# Altium schematic sheet DigitalCarrierJack.SchDoc
size A4; CompanyName: Technische Hochschule Nürnberg Georg Simon Ohm; Organization: UltraZohm; Address1: Kesslerplatz 12; Address2: 90489 Nürnberg; Address3: GERMANY; DocumentNumber: 2; SheetNumber: 2; SheetTotal: 3; Website: www.ultrazohm.com
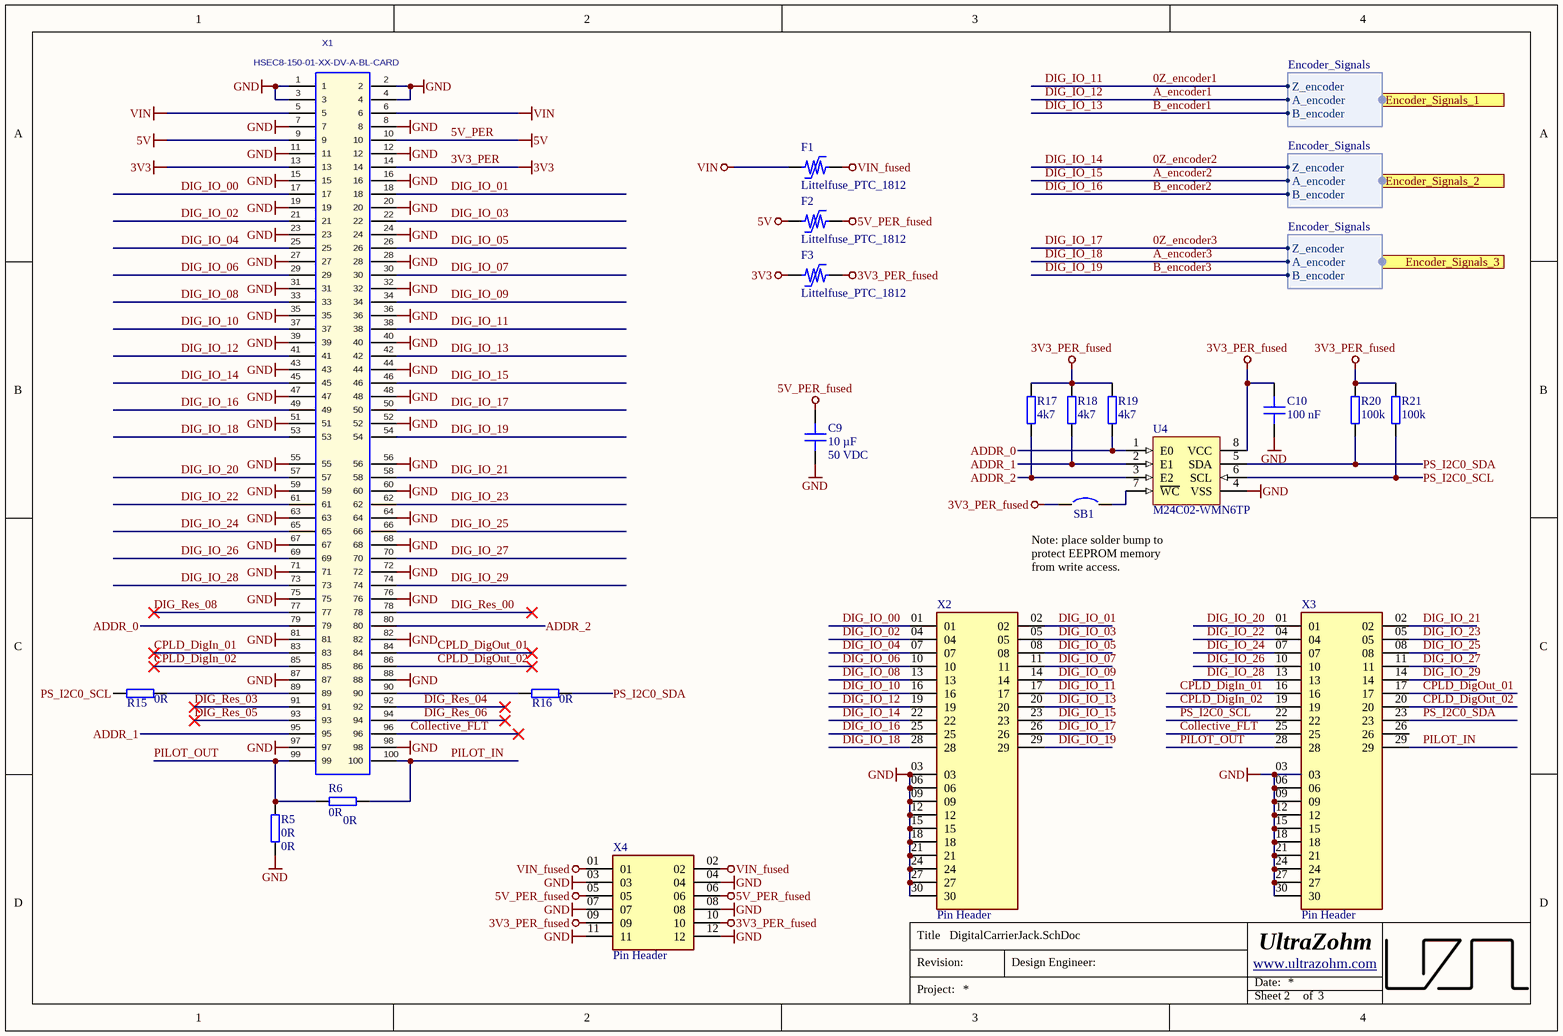
[diagram p0: DigitalCarrierJack.SchDoc]

## Parts
C9  10 µF  Voltage Rating: 50 VDC  [C_1206]
C10  100 nF  [C_0603]
F1  Littelfuse_PTC_1812  [1812_PTC_Polyfuse_Littelfuse]
F2  Littelfuse_PTC_1812  [1812_PTC_Polyfuse_Littelfuse]
F3  Littelfuse_PTC_1812  [1812_PTC_Polyfuse_Littelfuse]
R5  0R  [RES 0603_1608]
R6  0R  [RES 0603_1608]
R15  0R  [RES 0603_1608]
R16  0R  [RES 0603_1608]
R17  4k7  [RES 0603_1608]
R18  4k7  [RES 0603_1608]
R19  4k7  [RES 0603_1608]
R20  100k  [RES 0603_1608]
R21  100k  [RES 0603_1608]
SB1  (no value)  [SB_0603]  (no BOM)
U4  M24C02-WMN6TP  [D0008A_N]
X1  HSEC8-150-01-XX-DV-A-BL-CARD  [HSEC8-150-01-XX-DV-A-BL-CARD]  (no BOM)
X2  Pin Header  [SAMTEC_TSW-110-07-F-T]
X3  Pin Header  [SAMTEC_TSW-110-07-F-T]
X4  Pin Header  [SAMTEC_TSW-106-07-F-D]

## Ports
Encoder_Signals_1 (harness Encoder_Signals), Encoder_Signals_2 (harness Encoder_Signals), Encoder_Signals_3 (harness Encoder_Signals)

## Harnesses
Encoder_Signals: A_encoder, B_encoder, Z_encoder

## Nets
3V3_PER: F3.1 X1.13 X1.14  [also labelled 3V3]
3V3_PER_fused: C10.2 F3.2 R17.2 R18.2 R19.2 R20.2 R21.2 SB1.1 U4.8(VCC) X4.09 X4.10
5V_PER: F2.1 X1.9 X1.10  [also labelled 5V]
5V_PER_fused: C9.2 F2.2 X4.05 X4.06
GND: C9.1 C10.1 R5.1 U4.4(VSS) X1.1 X1.2 X1.3 X1.4 X1.7 X1.8 X1.11 X1.12 X1.15 X1.16 X1.19 X1.20 X1.23 X1.24 X1.27 X1.28 X1.31 X1.32 X1.35 X1.36 X1.39 X1.40 X1.43 X1.44 X1.47 X1.48 X1.51 X1.52 X1.55 X1.56 X1.59 X1.60 X1.63 X1.64 X1.67 X1.68 X1.71 X1.72 X1.75 X1.76 X1.81 X1.82 X1.87 X1.88 X1.97 X1.98 X2.03 X2.06 X2.09 X2.12 X2.15 X2.18 X2.21 X2.24 X2.27 X2.30 X3.03 X3.06 X3.09 X3.12 X3.15 X3.18 X3.21 X3.24 X3.27 X3.30 X4.03 X4.04 X4.07 X4.08 X4.11 X4.12
VIN: F1.1 X1.5 X1.6
VIN_fused: F1.2 X4.01 X4.02
0Z_encoder1: X1.38 X2.17 ; port Encoder_Signals_1.Z_encoder  [also labelled DIG_IO_11]
0Z_encoder2: X1.45 X2.22 ; port Encoder_Signals_2.Z_encoder  [also labelled DIG_IO_14]
0Z_encoder3: X1.50 X2.26 ; port Encoder_Signals_3.Z_encoder  [also labelled DIG_IO_17]
A_encoder1: X1.41 X2.19 ; port Encoder_Signals_1.A_encoder  [also labelled DIG_IO_12]
A_encoder2: X1.46 X2.23 ; port Encoder_Signals_2.A_encoder  [also labelled DIG_IO_15]
A_encoder3: X1.53 X2.28 ; port Encoder_Signals_3.A_encoder  [also labelled DIG_IO_18]
ADDR_0: R19.1 U4.1(E0) X1.79
ADDR_1: R18.1 U4.2(E1) X1.95
ADDR_2: R17.1 U4.3(E2) X1.80
B_encoder1: X1.42 X2.20 ; port Encoder_Signals_1.B_encoder  [also labelled DIG_IO_13]
B_encoder2: X1.49 X2.25 ; port Encoder_Signals_2.B_encoder  [also labelled DIG_IO_16]
B_encoder3: X1.54 X2.29 ; port Encoder_Signals_3.B_encoder  [also labelled DIG_IO_19]
Collective_FLT: X1.96 X3.25
CPLD_DigIn_01: X1.83 X3.16
CPLD_DigIn_02: X1.85 X3.19
CPLD_DigOut_01: X1.84 X3.17
CPLD_DigOut_02: X1.86 X3.20
DIG_IO_00: X1.17 X2.01
DIG_IO_01: X1.18 X2.02
DIG_IO_02: X1.21 X2.04
DIG_IO_03: X1.22 X2.05
DIG_IO_04: X1.25 X2.07
DIG_IO_05: X1.26 X2.08
DIG_IO_06: X1.29 X2.10
DIG_IO_07: X1.30 X2.11
DIG_IO_08: X1.33 X2.13
DIG_IO_09: X1.34 X2.14
DIG_IO_10: X1.37 X2.16
DIG_IO_20: X1.57 X3.01
DIG_IO_21: X1.58 X3.02
DIG_IO_22: X1.61 X3.04
DIG_IO_23: X1.62 X3.05
DIG_IO_24: X1.65 X3.07
DIG_IO_25: X1.66 X3.08
DIG_IO_26: X1.69 X3.10
DIG_IO_27: X1.70 X3.11
DIG_IO_28: X1.73 X3.13
DIG_IO_29: X1.74 X3.14
DIG_Res_00: X1.78
DIG_Res_03: X1.91
DIG_Res_04: X1.92
DIG_Res_05: X1.93
DIG_Res_06: X1.94
DIG_Res_08: X1.77
PILOT_IN: R6.2 X1.100 X3.29
PILOT_OUT: R5.2 R6.1 X1.99 X3.28
PS_I2C0_SCL: R15.1 R21.1 U4.6(SCL) X3.22
PS_I2C0_SDA: R16.2 R20.1 U4.5(SDA) X3.23
NetR15_2: R15.2 X1.89
NetR16_1: R16.1 X1.90
NetSB1_2: SB1.2 U4.7(~{WC})

Not connected (* = marked no-connect by the designer): X3 26

## Notes on the sheet
- Note: place solder bump to protect EEPROM memory from write access.
- Title
- Revision:
- Design Engineer:
- Date:
- Project:
- Sheet
- of

## Library data of the parts
C9 = CGA5L1X7R1H106K160AC: Capacitor 1206, 50 VDC, 10 µF, X7R; Manufacturer: TDK; Tolerance: 10 %; Created from: MGremer; Manufacturer Part Number: CGA5L1X7R1H106K160AC; PartID: 25; Created On: 20.12.2020 13:54:13; ComponentLink1Description: Datasheet; ComponentLink1URL: https://product.tdk.com/info/en/catalog/datasheets/mlcc_automotive_general_en.pdf; Component Type: Capacitor 1206; Device Package: 1206; Last Updated: 27.05.2022 14:15:21; Mounting Type: SMD; Operating Temperature: -55 - 125°C; Series: CGA; Supplier 1: Mouser; Supplier Part Number 1: 810-CGA5L1X7R1H106K1; Type: Capacitor; Value: 10 µF; Live Cycle Status: 1; LCSC Part Number: C13585; Stock number: Labor SMD Container
C10 = CC0603KRX7R9BB104: Capacitor 0603, 50 VDC, 100 nF, X7R; Manufacturer: YAGEO; Tolerance: 10 %; Voltage Rating: 50 VDC; Created from: AGeiger; Manufacturer Part Number: CC0603KRX7R9BB104; PartID: 102; Created On: 22/08/2022 14:35:53; ComponentLink1Description: Datasheet; ComponentLink1URL: https://datasheet.lcsc.com/lcsc/1809301912_YAGEO-CC0603KRX7R9BB104_C14663.pdf; Component Type: Capacitor 0603; Device Package: 0603; Last Updated: 22/08/2022 14:35:53; Mounting Type: SMD; Operating Temperature: -55 - 125°C; Series: X7R; Supplier 1: LCSC; Supplier Part Number 1: C14663; Supplier 2: Mouser; Supplier Part Number 2: 603-CC603KRX7R9BB104; Type: Capacitor; Value: 100 nF; Live Cycle Status: 1; LCSC Part Number: C14663
F1-F3 = Littelfuse_PTC_1812: POLYSWITCH RESETTABLE DEVICES; MPN: miniASMDC110F/24; Value: PTC, 1.1 A, 24V; Voltage: 24V; Trip Current: 2.2A; Hold Current: 1.1A; Resistance: 0.18 Ohm; Type: Fuse; Nominal current: 1 A; Created from: MHlatky; MF: Littelfuse; Created: 2019_02_10_AGeiger; Package: 1812; ComponentLink1URL: https://www.littelfuse.com/~/media/electronics/datasheets/resettable_ptcs/littelfuse_ptc_surface_mount_catalog_datasheet.pdf.pdf; ComponentLink1Description: Datasheet; Manufacturer Part Number: Littelfuse_PTC_1812; PartID: 5; Created On: 07.05.2021 06:50:33; Component Type: Littelfuse_PTC_1812; Last Updated: 27.05.2022 15:06:17; Manufacturer: Littelfuse; Mounting Type: SMD; Operating Temperature: -40 - 85 °C; Supplier 1: Mouser; Supplier Part Number 1: 530-0ZCG0150BF2C; Live Cycle Status: 1; LCSC Part Number: C70119
R5 R6 R15 R16 = RC0603JR-070RL: SMD resistor E24 series; Manufacturer: YAGEO; Tolerance: 5%; Created from: MGremer; Manufacturer Part Number: RC0603JR-070RL; PartID: 1; Created On: 14.12.2020 16:17:14; ComponentLink1Description: Datasheet; ComponentLink1URL: https://www.mouser.de/datasheet/2/447/PYu-RC_Group_51_RoHS_L_10-1664068.pdf; Component Type: SMD resistor; Device Package: 0603; Last Updated: 04.03.2021 09:09:42; Mounting Type: SMD; Supplier 1: Mouser; Supplier Part Number 1: 603-RC0603JR-070RL; Supplier 2: LCSC; Supplier Part Number 2: C21189; Type: Resistor; Value: 0R; Live Cycle Status: 1; Stock number: Labor SMD Container; LCSC Part Number: C21189
R17-R19 = RK73B1JTTD472J: SMD resistor E24 series; Manufacturer: KOA Speer; Tolerance: 5%; Created from: MGremer; Manufacturer Part Number: RK73B1JTTD472J; PartID: 90; Created On: 14.12.2020 16:17:14; ComponentLink1Description: Datasheet; ComponentLink1URL: https://www.mouser.de/datasheet/2/219/RK73B-1825463.pdf; Component Type: SMD resistor; Device Package: 0603; Last Updated: 27.05.2022 13:46:16; Mounting Type: SMD; Supplier 1: Mouser; Supplier Part Number 1: 660-RK73B1JTTD472J; Type: Resistor; Value: 4k7; Live Cycle Status: 1; Stock number: Labor SMD Container; LCSC Part Number: C23162
R20 R21 = RK73B1JTTD104J: SMD resistor E24 series; Manufacturer: KOA Speer; Tolerance: 5%; Created from: MGremer; Manufacturer Part Number: RK73B1JTTD104J; PartID: 122; Created On: 14.12.2020 16:17:14; ComponentLink1Description: Datasheet; ComponentLink1URL: https://www.mouser.de/datasheet/2/219/RK73B-1825463.pdf; Component Type: SMD resistor; Device Package: 0603; Last Updated: 27.05.2022 14:04:10; Mounting Type: SMD; Supplier 1: Mouser; Supplier Part Number 1: 660-RK73B1JTTD104J; Type: Resistor; Value: 100k; Live Cycle Status: 1; Stock number: Labor SMD Container; LCSC Part Number: C25803
SB1 = Solder Bump 0603: Created from: AGeiger; Revision: July-2002: Re-released for DXP Platform.; Manufacturer Part Number: Solder Bump 0603; PartID: 1; Created On: 09/01/2024 17:13:56; Component Type: Solder Bump; Device Package: 0603; Last Updated: 02/10/2025 12:53:47; Mounting Type: SMD; Value: Solder Bump 0603
U4 = M24C02-WMN6TP: 2Kbit I2C SOP-8 EEPROM ROHS; Manufacturer: STMicroelectronics; Created from: AGeiger; Manufacturer Part Number: M24C02-WMN6TP; PartID: 1; Created On: 19.11.2023 14:54:27; ComponentLink1Description: Datasheet; ComponentLink1URL: https://www.st.com/resource/en/datasheet/m24c01-w.pdf; Component Type: EEPROM; Device Package: SOIC-8; Last Updated: 19.11.2023 21:39:04; Mounting Type: SMD; Operating Temperature: -40 to +85 °C; Series: M24xxx; Supplier 1: Mouser; Supplier Part Number 1: 511-M24C02-WMN6TP; Supplier 2: LCSC; Supplier Part Number 2: C7562; Type: Memory; Value: M24C02-WMN6TP; LCSC Part Number: C7562
X1 = HSEC8-150-01-XX-DV-A-BL-CARD: Mating Card Layout for HSEC8-150-01-XX-DV-A-BL; Manufacturer: SAMTEC; Created: 2018_04_23_AGeiger; Value: HSEC8-150-01-XX-DV-A-BL-CARD
X2 X3 = TSW-110-07-F-T: THROUGH-HOLE .025" SQ POST HEADER; Manufacturer: SAMTEC; MF: Samtec Inc.; Created from: MHlatky; Value: *; MP: TSW-110-07-F-T; Package: None; Price: None; Availability: Unavailable; Manufacturer Part Number: TSW-110-07-F-T; PartID: 7; Created On: 22.11.2021 15:31:45; ComponentLink1Description: Datasheet; ComponentLink1URL: https://www.mouser.de/datasheet/2/527/tsw_th-2854687.pdf; Component Type: Pin Header; Device Package: THT; Last Updated: 20.12.2021 07:38:08; Mounting Type: THT; Operating Temperature: -55 +125 °C; Series: TSW; Supplier 1: Mouser; Supplier Part Number 1: 200-TSW11007FT; Type: Pin Header; Live Cycle Status: 1; Stock number: not stored
X4 = TSW-106-07-F-D: THROUGH-HOLE .025" SQ POST HEADER; MF: Samtec; Created from: MHlatky; MP: TSW-106-07-F-D; Price: None; Package: None; Value: *; Availability: Unavailable; Manufacturer Part Number: TSW-106-07-F-D; PartID: 8; Created On: 22.11.2021 15:31:45; ComponentLink1Description: Datasheet; ComponentLink1URL: https://www.mouser.de/datasheet/2/527/tsw_th-2854687.pdf; Component Type: Pin Header; Device Package: THT; Last Updated: 20.12.2021 07:38:08; Manufacturer: SAMTEC; Mounting Type: THT; Operating Temperature: -55 +125 °C; Series: TSW; Supplier 1: Mouser; Supplier Part Number 1: 200-TSW10607FD; Type: Pin Header; Live Cycle Status: 1; Stock number: not stored